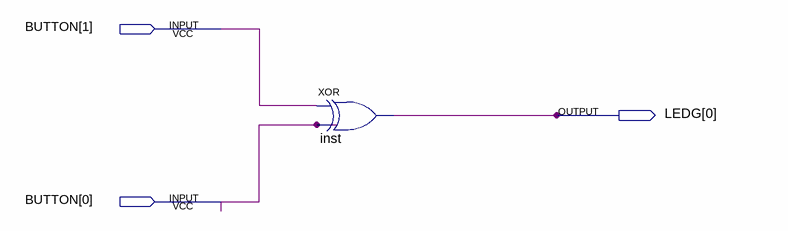
[diagram p0: schematic sheet]
// Quartus schematic my_xor.bdf as structural Verilog: 1 symbols, 3 pins
module my_xor (
  input  [1:0] BUTTON,
  output [0:0] LEDG
);

  xor inst (LEDG[0], BUTTON[1], BUTTON[0]);
endmodule
